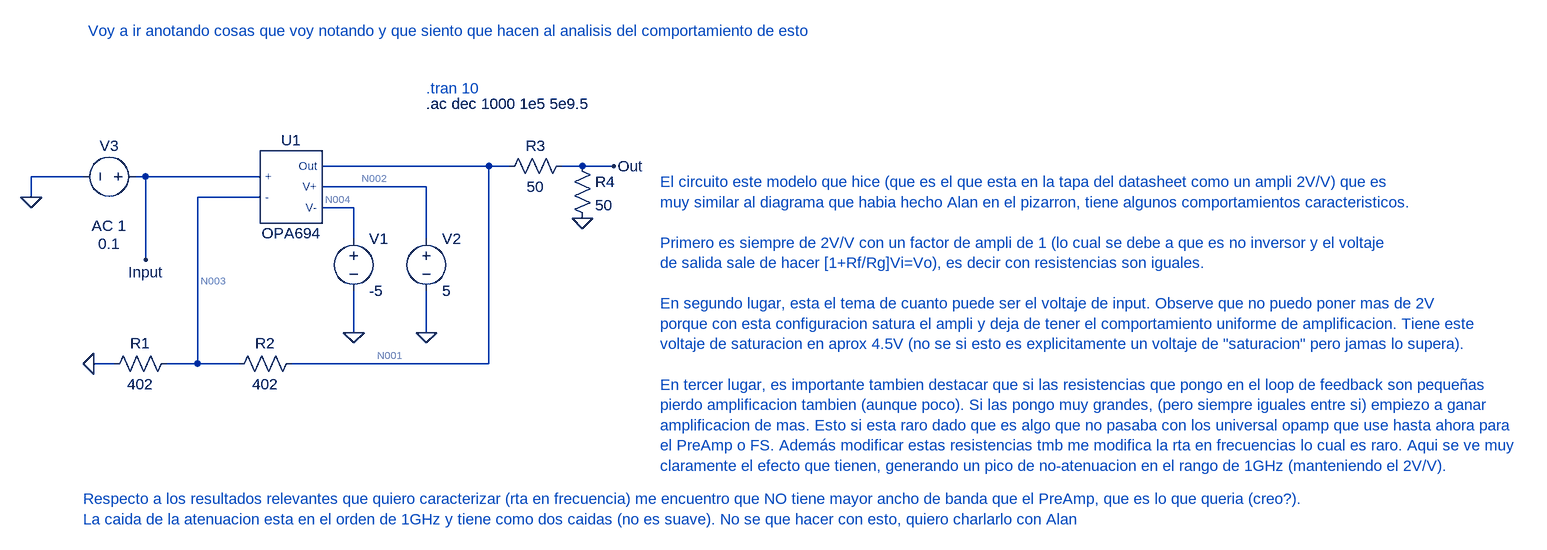
[diagram p0: schematic circuito_calibracion_v1.asc]
circuito_calibracion_v1.asc, the LTspice schematic file:
Version 4
SHEET 1 3012 680
WIRE 256 -96 0 -96
WIRE 288 -96 256 -96
WIRE 400 -96 368 -96
WIRE 448 -96 400 -96
WIRE -368 -80 -448 -80
WIRE -272 -80 -288 -80
WIRE -96 -80 -272 -80
WIRE 160 -64 0 -64
WIRE -448 -48 -448 -80
WIRE -96 -48 -192 -48
WIRE 48 -32 0 -32
WIRE 48 16 48 -32
WIRE 160 16 160 -64
WIRE -272 48 -272 -80
WIRE 48 160 48 96
WIRE 160 160 160 96
WIRE -320 208 -352 208
WIRE -192 208 -192 -48
WIRE -192 208 -240 208
WIRE -128 208 -192 208
WIRE 256 208 256 -96
WIRE 256 208 -48 208
FLAG 48 160 0
FLAG 160 160 0
FLAG -448 -48 0
FLAG 448 -96 Out
FLAG -352 208 0
FLAG -272 48 Input
FLAG 400 -16 0
SYMBOL AutoGenerated\\OPA694 -48 -64 R0
SYMATTR InstName U1
SYMBOL voltage 48 0 R0
WINDOW 123 0 0 Left 0
WINDOW 39 0 0 Left 0
SYMATTR InstName V1
SYMATTR Value -5
SYMBOL res -224 192 R90
WINDOW 0 0 56 VBottom 2
WINDOW 3 32 56 VTop 2
SYMATTR InstName R1
SYMATTR Value 402
SYMBOL voltage -272 -80 R90
WINDOW 0 -32 56 VBottom 2
WINDOW 3 88 56 VTop 2
WINDOW 123 60 56 VTop 2
WINDOW 39 0 0 Left 0
SYMATTR InstName V3
SYMATTR Value 0.1
SYMATTR Value2 AC 1
SYMBOL res -144 224 R270
WINDOW 0 32 56 VTop 2
WINDOW 3 0 56 VBottom 2
SYMATTR InstName R2
SYMATTR Value 402
SYMBOL res 272 -80 R270
WINDOW 0 32 56 VTop 2
WINDOW 3 0 56 VBottom 2
SYMATTR InstName R3
SYMATTR Value 50
SYMBOL voltage 160 0 R0
WINDOW 123 0 0 Left 0
WINDOW 39 0 0 Left 0
SYMATTR InstName V2
SYMATTR Value 5
SYMBOL res 384 -112 R0
SYMATTR InstName R4
SYMATTR Value 50
TEXT 160 -192 Left 2 !.ac dec 1000 1e5 5e9.5
TEXT 160 -216 Left 2 ;.tran 10
TEXT -360 -304 Left 2 ;Voy a ir anotando cosas que voy notando y que siento que hacen al analisis del comportamiento de esto
TEXT 520 -72 Left 2 ;El circuito este modelo que hice (que es el que esta en la tapa del datasheet como un ampli 2V/V) que es \nmuy similar al diagrama que habia hecho Alan en el pizarron, tiene algunos comportamientos caracteristicos.\n \nPrimero es siempre de 2V/V con un factor de ampli de 1 (lo cual se debe a que es no inversor y el voltaje\nde salida sale de hacer [1+Rf/Rg]Vi=Vo), es decir con resistencias son iguales.\n \nEn segundo lugar, esta el tema de cuanto puede ser el voltaje de input. Observe que no puedo poner mas de 2V\nporque con esta configuracion satura el ampli y deja de tener el comportamiento uniforme de amplificacion. Tiene este\nvoltaje de saturacion en aprox 4.5V (no se si esto es explicitamente un voltaje de "saturacion" pero jamas lo supera).\n \nEn tercer lugar, es importante tambien destacar que si las resistencias que pongo en el loop de feedback son pequeñas \npierdo amplificacion tambien (aunque poco). Si las pongo muy grandes, (pero siempre iguales entre si) empiezo a ganar\namplificacion de mas. Esto si esta raro dado que es algo que no pasaba con los universal opamp que use hasta ahora para \nel PreAmp o FS. Además modificar estas resistencias tmb me modifica la rta en frecuencias lo cual es raro. Aqui se ve muy\nclaramente el efecto que tienen, generando un pico de no-atenuacion en el rango de 1GHz (manteniendo el 2V/V).
TEXT -368 416 Left 2 ;Respecto a los resultados relevantes que quiero caracterizar (rta en frecuencia) me encuentro que NO tiene mayor ancho de banda que el PreAmp, que es lo que queria (creo?).\nLa caida de la atenuacion esta en el orden de 1GHz y tiene como dos caidas (no es suave). No se que hacer con esto, quiero charlarlo con Alan

The netlist it stands for:
* circuito_calibracion_v1.asc
XU1 Input N003 N001 N002 N004 OPA694  ; pins + - Out V+ V-
V1 N004 0 -5
R1 N003 0 402
V3 Input 0 0.1 AC 1
R2 N003 N001 402
R3 N001 Out 50
V2 N002 0 5
R4 Out 0 50
.ac dec 1000 1e5 5e9.5
* .tran 10
* Voy a ir anotando cosas que voy notando y que siento que hacen al analisis del comportamiento de esto
* El circuito este modelo que hice (que es el que esta en la tapa del datasheet como un ampli 2V/V) que es
* muy similar al diagrama que habia hecho Alan en el pizarron, tiene algunos comportamientos caracteristicos.
* Primero es siempre de 2V/V con un factor de ampli de 1 (lo cual se debe a que es no inversor y el voltaje
* de salida sale de hacer [1+Rf/Rg]Vi=Vo), es decir con resistencias son iguales.
* En segundo lugar, esta el tema de cuanto puede ser el voltaje de input. Observe que no puedo poner mas de 2V
* porque con esta configuracion satura el ampli y deja de tener el comportamiento uniforme de amplificacion. Tiene este
* voltaje de saturacion en aprox 4.5V (no se si esto es explicitamente un voltaje de "saturacion" pero jamas lo supera).
* En tercer lugar, es importante tambien destacar que si las resistencias que pongo en el loop de feedback son pequeñas
* pierdo amplificacion tambien (aunque poco). Si las pongo muy grandes, (pero siempre iguales entre si) empiezo a ganar
* amplificacion de mas. Esto si esta raro dado que es algo que no pasaba con los universal opamp que use hasta ahora para
* el PreAmp o FS. Además modificar estas resistencias tmb me modifica la rta en frecuencias lo cual es raro. Aqui se ve muy
* claramente el efecto que tienen, generando un pico de no-atenuacion en el rango de 1GHz (manteniendo el 2V/V).
* Respecto a los resultados relevantes que quiero caracterizar (rta en frecuencia) me encuentro que NO tiene mayor ancho de banda que el PreAmp, que es lo que queria (creo?).
* La caida de la atenuacion esta en el orden de 1GHz y tiene como dos caidas (no es suave). No se que hacer con esto, quiero charlarlo con Alan
.lib C:\Users\smili\Downloads\sboc068b\opa694.lib
.backanno
.end

* Results of the author's LTspice run, read from the files saved beside the schematic
* Operating Point, zero values left out:
*   V(n002) = 5 V
*   V(n001) = 199.2 mV
*   V(input) = 100 mV
*   V(n003) = 97.02 mV
*   V(n004) = -5 V
*   V(out) = 99.58 mV
*   I(R1) = 241.4 µA
*   I(R2) = -254.1 µA
*   I(R3) = 1.992 mA
*   I(R4) = 1.992 mA
*   I(V1) = 5.464 mA
*   I(V3) = 6.906 µA
*   I(V2) = -7.705 mA
*   Ix(u1:+) = -6.906 µA
*   Ix(u1:-) = 12.73 µA
*   Ix(u1:OUT) = -2.246 mA
*   Ix(u1:V+) = 7.705 mA
*   Ix(u1:V-) = -5.464 mA
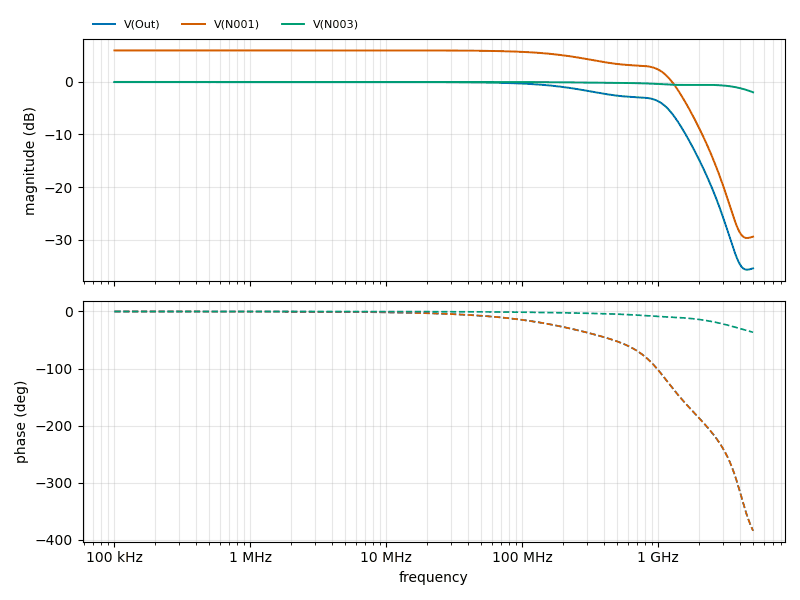
[diagram p1: AC Analysis of circuito_calibracion_v1.asc, plotted from the saved traces]
* AC Analysis, 1 run:
*   V(Out): -0.05 dB at 100 kHz, -35.43 dB at 5 GHz, peak -0.05 dB at 100 kHz, 3 dB below the peak at 831.1 MHz
*   V(N001): 5.97 dB at 100 kHz, -29.41 dB at 5 GHz, peak 5.97 dB at 100 kHz, 3 dB below the peak at 831.1 MHz
*   V(N003): -0.02 dB at 100 kHz, -1.98 dB at 5 GHz, peak -0.02 dB at 100 kHz